# Altium schematic sheet [8]-DAC & MIC.SchDoc
size A4; Organization: Altium Limited; Address1: L3, 12a Rodborough Rd; Address2: Frenchs Forest; Address3: NSW; Address4: Australia 2086
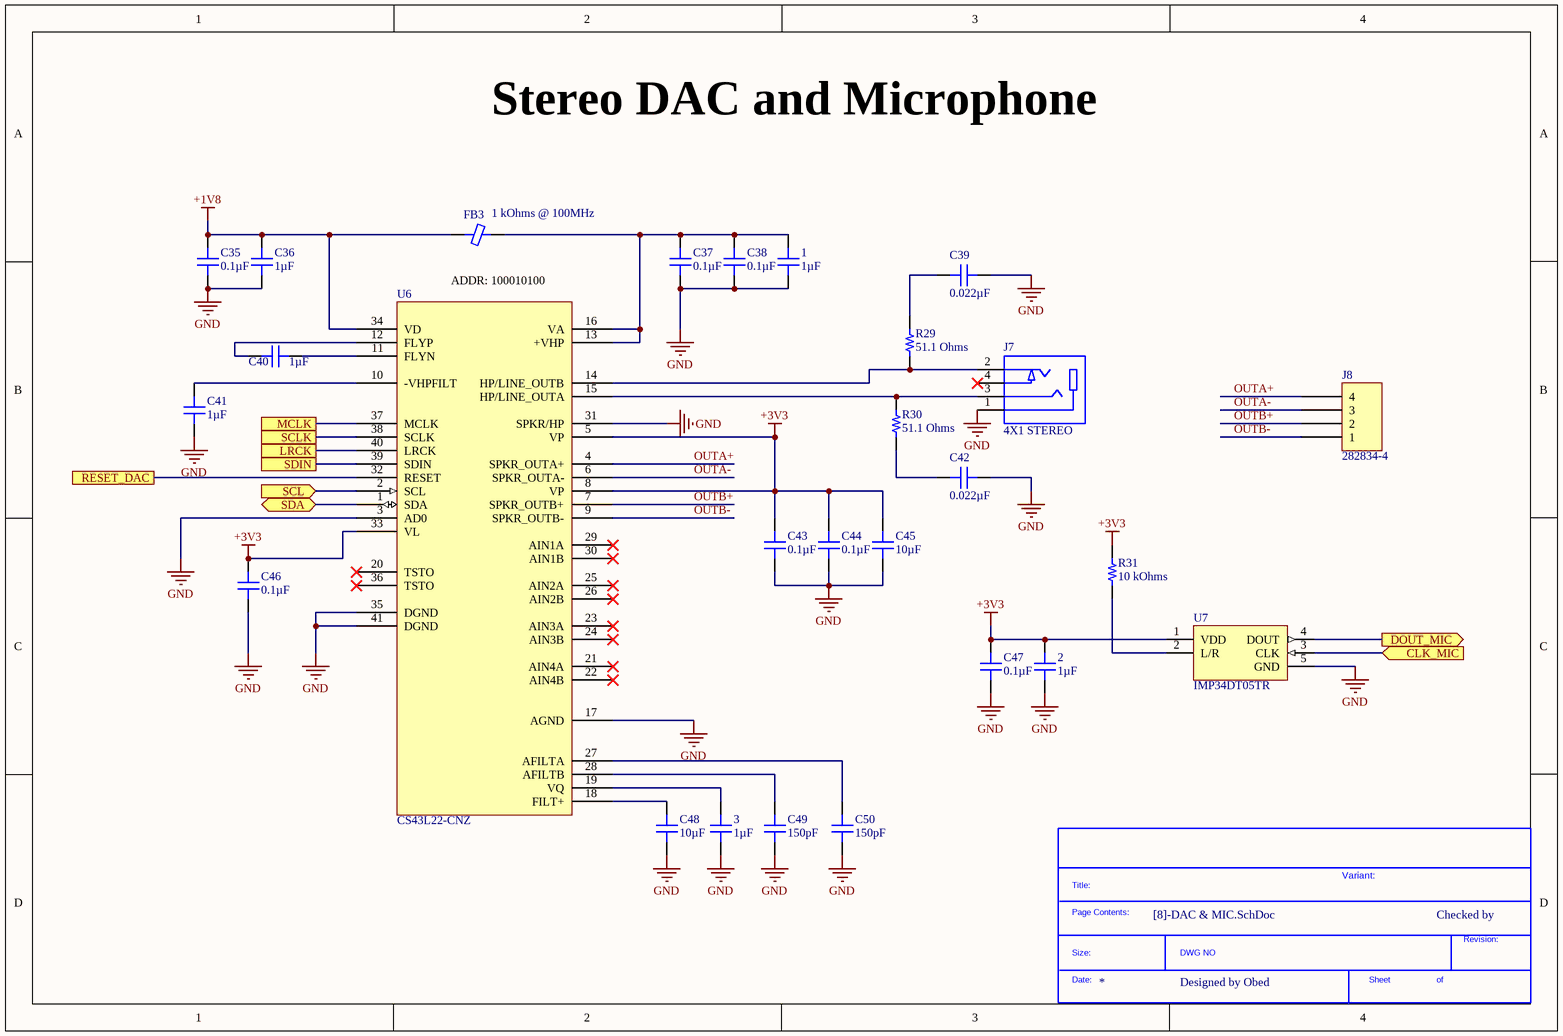
[diagram p0: [8]-DAC & MIC.SchDoc]

## Parts
1  1µF  [CAP 0805_2012]
2  1µF  [CAP 0805_2012]
3  1µF  [CAP 0805_2012]
*?  SDTitleBlock  (value not drawn)  (graphical)
C35  0.1µF  [CAP 0805_2012]
C36  1µF  [CAP 0805_2012]
C37  0.1µF  [CAP 0805_2012]
C38  0.1µF  [CAP 0805_2012]
C39  0.022µF  [CAP 0805_2012]
C40  1µF  [CAP 0805_2012]
C41  1µF  [CAP 0805_2012]
C42  0.022µF  [CAP 0805_2012]
C43  0.1µF  [CAP 0805_2012]
C44  0.1µF  [CAP 0805_2012]
C45  10µF  [CAP 1206_3216 - 1.8MM]
C46  0.1µF  [CAP 0805_2012]
C47  0.1µF  [CAP 0805_2012]
C48  10µF  [CAP 1206_3216 - 1.8MM]
C49  150pF  [CAP 0805_2012]
C50  150pF  [CAP 0805_2012]
FB3  1 kOhms @ 100MHz  [FER 1206_3216]
J7  4X1 STEREO  [CON_SJ-2504A-SMT-TR_SMD]
J8  282834-4  [TE 282834-4]
R29  51.1 Ohms  [RES 0603_1608]
R30  51.1 Ohms  [RES 0603_1608]
R31  10 kOhms  [RES 0805_2012]
U6  CS43L22-CNZ  [QFN40_19_284_33X9_SMD]
U7  IMP34DT05TR  [HCLGA-4_53_137_15X37_SMD]

## Ports
CLK_MIC (in), DOUT_MIC (out), LRCK, MCLK, RESET_DAC, SCL (in), SCLK, SDA (bidir), SDIN

## Nets
+1V8: C35.2 C36.2 FB3.1 U6.34(VD)
+3V3: 2.2 C43.2 C44.2 C45.2 C46.2 C47.2 R31.1 U6.5(VP) U6.8(VP) U6.33(VL) U7.1(VDD)
GND: 1.1 2.1 3.1 C35.1 C36.1 C37.1 C38.1 C39.2 C41.2 C42.2 C43.1 C44.1 C45.1 C46.1 C47.1 C48.1 C49.1 C50.1 J7.1 U6.3(AD0) U6.17(AGND) U6.31(SPKR/HP) U6.35(DGND) U6.41(DGND) U7.5(GND)
CLK_MIC: U7.3(CLK) ; port CLK_MIC
DOUT_MIC: U7.4(DOUT) ; port DOUT_MIC
LRCK: U6.40(LRCK) ; port LRCK
MCLK: U6.37(MCLK) ; port MCLK
OUTA+: J8.4 U6.4(SPKR_OUTA+)
OUTA-: J8.3 U6.6(SPKR_OUTA-)
OUTB+: J8.2 U6.7(SPKR_OUTB+)
OUTB-: J8.1 U6.9(SPKR_OUTB-)
RESET_DAC: U6.32(RESET) ; port RESET_DAC
SCL: U6.2(SCL) ; port SCL
SCLK: U6.38(SCLK) ; port SCLK
SDA: U6.1(SDA) ; port SDA
SDIN: U6.39(SDIN) ; port SDIN
Net1_2: 1.2 C37.2 C38.2 FB3.2 U6.13(+VHP) U6.16(VA)
Net3_2: 3.2 U6.19(VQ)
NetC39_1: C39.1 R29.2
NetC40_1: C40.1 U6.11(FLYN)
NetC40_2: C40.2 U6.12(FLYP)
NetC41_1: C41.1 U6.10(-VHPFILT)
NetC42_1: C42.1 R30.1
NetC48_2: C48.2 U6.18(FILT+)
NetC49_2: C49.2 U6.28(AFILTB)
NetC50_2: C50.2 U6.27(AFILTA)
NetJ7_2: J7.2 R29.1 U6.14(HP/LINE_OUTB)
NetJ7_3: J7.3 R30.2 U6.15(HP/LINE_OUTA)
NetR31_2: R31.2 U7.2(L/R)

Not connected (* = marked no-connect by the designer): J7 4*; U6 20(TSTO)* 21(AIN4A)* 22(AIN4B)* 23(AIN3A)* 24(AIN3B)* 25(AIN2A)* 26(AIN2B)* 29(AIN1A)* 30(AIN1B)* 36(TSTO)*

## Notes on the sheet
- Stereo DAC and Microphone
- ADDR: 100010100
- Variant:
- Checked by
- Designed by Obed
- Title
- Size:
- Date:
- File:
- A2
- Number:
- Time:
- Revision:
- Sheet
- of
- (in symbol SDTitleBlock) Title:; Page Contents:; Revision:; Size:; DWG NO; Date:; Sheet; of

## Library data of the parts
1-3 C36 C40 C41 = 08055C105K4T2A: CAP CER 1UF 50V X7R 0805; Manufacturer: AVX Corporation; Tolerance: ±10%; Part Number: 08055C105K4T2A; Value: 1µF; Applications: Automotive; Capacitance: 1µF; ComponentLink1Description: Datasheet; ComponentLink1URL: http://datasheets.avx.com/AutoMLCC.pdf; ComponentLink2Description: DigiKey Link; ComponentLink2URL: http://digikey.com/product-detail/en/avx-corporation/08055C105K4T2A/478-9556-1-ND/5322894; Device Package: 0805 (2012 Metric); LastUpdated: 02/09/2020 01:04:35; Lifecycle Status: Active; Minimum Order: 1; Mounting Type: Surface Mount, MLCC; Operating Temperature: -55°C ~ 125°C; Package / Case: 0805 (2012 Metric); Packaging: TapeAndReel; PartId: 6460; Part Status: Active; Price: 0.08; Ratings: AEC-Q200; Series: -; Size / Dimension: 0.079" L x 0.049" W (2.00mm x 1.25mm); Supplier 1: DigiKey; Supplier Part Number 1: 478-9556-1-ND; Temperature Coefficient: X7R; Thickness (Max): 0.055" (1.40mm); Voltage - Rated: 50V
C35 C37 C38 C43 C44 C46 C47 = 0805J0500104KXT: CAP CER 0.1UF 50V X7R 0805; Manufacturer: Knowles Syfer; Tolerance: ±10%; Part Number: 0805J0500104KXT; Value: 0.1µF; Applications: General Purpose; Capacitance: 0.1µF; ComponentLink1Description: Datasheet; ComponentLink1URL: https://www.knowlescapacitors.com/getattachment/2dbfc8bc-e2b3-4b4d-afb1-43b011b9ebe0/High-Std-Voltage.aspx; ComponentLink2Description: DigiKey Link; ComponentLink2URL: http://digikey.com/product-detail/en/knowles-syfer/0805J0500104KXT/1608-1000-1-ND/5730199; Device Package: 0805 (2012 Metric); LastUpdated: 02/09/2020 01:04:31; Lifecycle Status: Active; Minimum Order: 1; Mounting Type: Surface Mount, MLCC; Operating Temperature: -55°C ~ 125°C; Package / Case: 0805 (2012 Metric); Packaging: TapeAndReel; PartId: 8322; Part Status: Active; Price: 0.17; Series: -; Size / Dimension: 0.079" L x 0.049" W (2.00mm x 1.25mm); Supplier 1: DigiKey; Supplier Part Number 1: 1608-1000-1-ND; Temperature Coefficient: X7R; Thickness (Max): 0.051" (1.30mm); Voltage - Rated: 50V
C39 C42 = C0805C223K5RECAUTO: CAP CER 0805 22NF 50V X7R 10%; Manufacturer: KEMET; Part Number: C0805C223K5RECAUTO; Value: 0.022µF; Applications: Automotive, ESD Protection; Capacitance: 0.022µF; ComponentLink1Description: Datasheet; ComponentLink1URL: https://api.kemet.com/component-edge/download/datasheet/C0805C223K5RECAUTO.pdf; ComponentLink2Description: DigiKey Link; ComponentLink2URL: http://digikey.com/product-detail/en/kemet/C0805C223K5RECAUTO/399-17886-1-ND/8640553; Device Package: 0805 (2012 Metric); LastUpdated: 9/2/2020 01:04:15; Lifecycle Status: Active; Minimum Order: 1; Mounting Type: Surface Mount, MLCC; Operating Temperature: -55°C ~ 125°C; Package / Case: 0805 (2012 Metric); Packaging: TapeAndReel; PartId: 15719; Part Status: Active; Price: 0.05; Ratings: AEC-Q200; Series: ESD SMD Auto X7R; Size / Dimension: 0.079" L x 0.049" W (2.00mm x 1.25mm); Supplier 1: DigiKey; Supplier Part Number 1: 399-17886-1-ND; Temperature Coefficient: X7R; Thickness (Max): 0.035" (0.88mm); Tolerance: ±10%; Voltage - Rated: 50V
C45 C48 = 12065D106KAT2A: CAP CER 10UF 50V X5R 1206; Manufacturer: AVX Corporation; Tolerance: ±10%; Part Number: 12065D106KAT2A; Value: 10µF; Applications: General Purpose; Capacitance: 10µF; ComponentLink1Description: Datasheet; ComponentLink1URL: http://datasheets.avx.com/cx5r.pdf; ComponentLink2Description: DigiKey Link; ComponentLink2URL: http://digikey.com/product-detail/en/avx-corporation/12065D106KAT2A/478-9979-1-ND/6149060; Device Package: 1206 (3216 Metric); LastUpdated: 02/09/2020 01:05:35; Lifecycle Status: Active; Minimum Order: 1; Mounting Type: Surface Mount, MLCC; Operating Temperature: -55°C ~ 85°C; Package / Case: 1206 (3216 Metric); Packaging: TapeAndReel; PartId: 21345; Part Status: Active; Price: 0.16; Series: -; Size / Dimension: 0.126" L x 0.063" W (3.20mm x 1.60mm); Supplier 1: DigiKey; Supplier Part Number 1: 478-9979-1-ND; Temperature Coefficient: X5R; Thickness (Max): 0.071" (1.80mm); Voltage - Rated: 50V
C49 C50 = 08055A151KAT2A: CAP CER 150PF 50V NP0 0805; Manufacturer: AVX Corporation; Temperature Coefficient: C0G, NP0; Tolerance: ±10%; Part Number: 08055A151KAT2A; Value: 150pF; Applications: General Purpose; Capacitance: 150pF; ComponentLink1Description: Datasheet; ComponentLink1URL: http://datasheets.avx.com/C0GNP0-Dielectric.pdf; ComponentLink2Description: DigiKey Link; ComponentLink2URL: http://digikey.com/product-detail/en/avx-corporation/08055A151KAT2A/478-10501-1-ND/6797479; Device Package: 0805 (2012 Metric); LastUpdated: 9/2/2020 01:04:10; Lifecycle Status: Active; Minimum Order: 1; Mounting Type: Surface Mount, MLCC; Operating Temperature: -55°C ~ 125°C; Package / Case: 0805 (2012 Metric); Packaging: TapeAndReel; PartId: 17161; Part Status: Active; Price: 0.02; Series: -; Size / Dimension: 0.079" L x 0.049" W (2.01mm x 1.25mm); Supplier 1: DigiKey; Supplier Part Number 1: 478-10501-1-ND; Thickness (Max): 0.037" (0.94mm); Voltage - Rated: 50V
FB3 = BLM31KN102SZ1L: FERRITE BEAD 1 KOHM 1206 1LN; Manufacturer: Murata Electronics; Current Rating (Max): 2A; DC Resistance (DCR) (Max): 75mOhm; Filter Type: Power Line; Number of Lines: 1; Part Number: BLM31KN102SZ1L; ComponentLink1Description: Datasheet; ComponentLink1URL: https://www.murata.com/en-global/products/productdata/8796751200286/QNFA9115.pdf; ComponentLink2Description: DigiKey Link; ComponentLink2URL: http://digikey.com/product-detail/en/murata-electronics/BLM31KN102SZ1L/490-16522-1-ND/7564150; Device Package: 1206 (3216 Metric); Height (Max): 0.071" (1.80mm); Impedance @ Frequency: 1 kOhms @ 100MHz; LastUpdated: 02/09/2020 01:18:24; Lifecycle Status: Active; Minimum Order: 1; Mounting Type: Surface Mount; Operating Temperature: -55°C ~ 125°C; Package / Case: 1206 (3216 Metric); Packaging: TapeAndReel; PartId: 1565; Part Status: Active; Price: 0.10; Ratings: AEC-Q200; Series: BLM; Size / Dimension: 0.126" L x 0.063" W (3.20mm x 1.60mm); Supplier 1: DigiKey; Supplier Part Number 1: 490-16522-1-ND; Value: 1 kOhms @ 100MHz
J7 = CON-PLG-STEREO_4X1-100-RA-SMD: 2.50mm (0.094", 3/32", Sub Mini, Miniature) - Headphone Phone Jack Stereo (4 Conductor, TRRS) Connector Solder; Manufacturer: CUI Devices; Manufacturer Part Number: SJ-2504A-SMT-TR; Alternate Part Number-1: NA; Case/Package: SMD; Supplier Part Number-1: CP-SJ-2504A-SMT-CT-ND - Cut Tape (CT); Supplier-1: Digikey
J8 = 282834-4: TERM BLK 4P SIDE ENT 2.54MM PCB; Manufacturer: TE Connectivity AMP Connectors; Current: 10A; Mating Orientation: Horizontal with Board; Number of Levels: 1; Pitch: 0.100" (2.54mm); Positions Per Level: 4; Voltage: 150V; Wire Gauge: 16-30 AWG; Wire Termination: Screw - Rising Cage Clamp; Part Number: 282834-4; Color: Green; ComponentLink1Description: Datasheet; ComponentLink1URL: https://www.te.com/commerce/DocumentDelivery/DDEController?Action=srchrtrv&DocNm=282834&DocType=Customer+Drawing&DocLang=English; ComponentLink2Description: DigiKey Link; ComponentLink2URL: http://digikey.com/product-detail/en/te-connectivity-amp-connectors/282834-4/A98335-ND/1153265; LastUpdated: 1/15/2020 04:16:05; Lifecycle Status: Active; Minimum Order: 1; Mounting Type: Through Hole; Packaging: Bulk; Part Status: Active; Price: 2.68; Series: Buchanan; Supplier 1: DigiKey; Supplier Part Number 1: A98335-ND
R29 R30 = RK73H1JTTD51R1F: RES 51.1 OHM 1% 1/8W 0603; Manufacturer: KOA Speer Electronics, Inc.; Power (Watts): 0.125W, 1/8W; Temperature Coefficient: ±100ppm/°C; Part Number: RK73H1JTTD51R1F; Value: 51.1 Ohms; ComponentLink1Description: Datasheet; ComponentLink1URL: http://www.koaspeer.com/catimages/Products/RK73H/RK73H.pdf; ComponentLink2Description: DigiKey Link; ComponentLink2URL: http://digikey.com/product-detail/en/koa-speer-electronics-inc/RK73H1JTTD51R1F/2019-RK73H1JTTD51R1FCT-ND/9847024; Composition: Thick Film; Device Package: 0603 (1608 Metric); Features: Automotive AEC-Q200, Moisture Resistant; Height - Seated (Max): 0.022" (0.55mm); LastUpdated: 9/2/2020 01:10:22; Lifecycle Status: Active; Minimum Order: 1; Number of Terminations: 2; Operating Temperature: -55°C ~ 155°C; Package / Case: 0603 (1608 Metric); Packaging: CutTape; PartId: 6134; Part Status: Active; Price: 0.10; Ratings: AEC-Q200; Resistance: 51.1 Ohms; Series: RK73H; Size / Dimension: 0.063" L x 0.031" W (1.60mm x 0.80mm); Supplier 1: DigiKey; Supplier Part Number 1: 2019-RK73H1JTTD51R1FCT-ND; Supplier Device Package: 0603; Tolerance: ±1%
R31 = CRCW080510K0FKEA: RES SMD 10K OHM 1% 1/8W 0805; Manufacturer: Vishay Dale; Power (Watts): 0.125W, 1/8W; Temperature Coefficient: ±100ppm/°C; Part Number: CRCW080510K0FKEA; Value: 10 kOhms; ComponentLink1Description: Datasheet; ComponentLink1URL: http://www.vishay.com/docs/20035/dcrcwe3.pdf; ComponentLink2Description: DigiKey Link; ComponentLink2URL: http://digikey.com/product-detail/en/vishay-dale/CRCW080510K0FKEA/541-10.0KCCT-ND/1180897; Composition: Thick Film; Device Package: 0805 (2012 Metric); Features: Automotive AEC-Q200; Height - Seated (Max): 0.020" (0.50mm); LastUpdated: 02/09/2020 01:15:23; Lifecycle Status: Active; Minimum Order: 1; Number of Terminations: 2; Operating Temperature: -55°C ~ 155°C; Package / Case: 0805 (2012 Metric); Packaging: TapeAndReel; PartId: 28101; Part Status: Active; Price: 0.01; Ratings: AEC-Q200; Resistance: 10 kOhms; Series: CRCW; Size / Dimension: 0.079" L x 0.049" W (2.00mm x 1.25mm); Supplier 1: DigiKey; Supplier Part Number 1: 541-10.0KCCT-ND; Supplier Device Package: 0805; Tolerance: ±1%
U6 = IC_CS43L22-CNZ: Audio D/A Converter ICs Low Power Stereo DAC w/ClassD Spkr Driver; Manufacturer: Cirrus Logic; Number of DAC Channels: 1; Resolution: 24b; Conversion Rate: 96KS/s; Output Type: Voltage; Max Supply Voltage: 2.63V; Min Supply Voltage: 1.65V; Interface: I2C,Serial; Sampling Rate: 96000S/s; Polarity: Bipolar; Supply Type: Analog,Digital; Operating Supply Voltage: 2.5V; Number of Bits: 24; Manufacturer Part Number: CS43L22-CNZ; RoHS: Yes; Category: Digital to Analog Converters (DACs); Pricing 1: 1=5.98000, 10=5.37400, 25=5.08000, 100=4.40270, 250=4.17692, 500=3.74794, 1000=3.19500 (USD); Mount: Surface Mount; Case/Package: QFN; Number of Pins: 40; Contact Plating: Tin,Matte; Min Operating Temperature: -40°C; Max Operating Temperature: 85°C; Package Quantity: 50; Packaging: Tray; Number of Converters: 1; Output Polarity: Bipolar; Series: -; Number of Channels: 1; Length: 6mm; Width: 6mm; Height: 0.95mm; RoHS Compliant: Yes; ComponentLink1URL: https://datasheet.ciiva.com/1494/91818-1494314.pdf?src-supplier=Element14; ComponentLink1Description: https://datasheet.ciiva.com/1494/91818-1494314.pdf?src-supplier=Element14; ComponentLink2URL: https://datasheet.ciiva.com/26802/cs43l22-cnz-26802243.pdf?src-supplier=IIIC; ComponentLink2Description: https://datasheet.ciiva.com/26802/cs43l22-cnz-26802243.pdf?src-supplier=IIIC; ComponentLink3URL: https://datasheet.ciiva.com/6665/cs43l22-f2-6665692.pdf?src-supplier=Digi-Key; ComponentLink3Description: https://datasheet.ciiva.com/6665/cs43l22-f2-6665692.pdf?src-supplier=Digi-Key; ComponentLink4URL: https://datasheet.ciiva.com/3040/cs43l22-f2-3040429.pdf?src-supplier=Avnet; ComponentLink4Description: https://datasheet.ciiva.com/3040/cs43l22-f2-3040429.pdf?src-supplier=Avnet; ComponentLink5URL: https://datasheet.ciiva.com/16606/cs43l22-f2-16606863.pdf?src-supplier=Avnet+Europe; ComponentLink5Description: https://datasheet.ciiva.com/16606/cs43l22-f2-16606863.pdf?src-supplier=Avnet+Europe; Supplier 1: Digi-Key; Supplier Part Number 1: 598-1650-ND
U7 = IC_IMP34DT05TR: MEMS Microphones AUTO & INDUSTRIAL SENSORS; Manufacturer: STMicroelectronics; Alternate Part Number-1: NA; Manufacturer Part Number: IMP34DT05TR; Case/Package: HCLGA-4; Supplier-1: Mouser; Supplier Part Number-1: 511-IMP34DT05TR